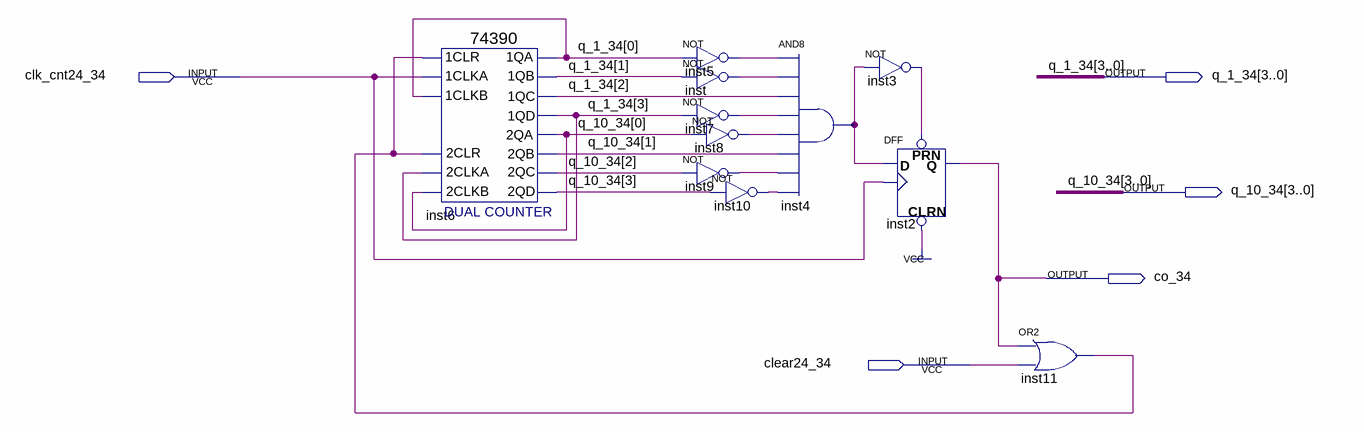
[diagram p0: schematic sheet]
// Quartus schematic cnt24_34.bdf as structural Verilog: 11 symbols, 5 pins
module cnt24_34 (
  input  clk_cnt24_34,
  input  clear24_34,
  output [3:0] q_1_34,
  output [3:0] q_10_34,
  output co_34
);

  wire inst3_out, inst4_out, inst5_out, inst7_out, inst8_out, inst9_out, inst10_out, inst11_out, inst_out;

  \74390  inst6 (
    .\2CLKA (q_1_34[3]), .\2CLR (inst11_out), .\2CLKB (q_10_34[0]), .\1CLR (inst11_out),
    .\1CLKA (clk_cnt24_34), .\1CLKB (q_1_34[0]), .\1QA (q_1_34[0]), .\1QB (q_1_34[1]), .\1QC (q_1_34[2]),
    .\1QD (q_1_34[3]), .\2QA (q_10_34[0]), .\2QB (q_10_34[1]), .\2QC (q_10_34[2]), .\2QD (q_10_34[3]));
  not inst5 (inst5_out, q_1_34[0]);
  not inst (inst_out, q_1_34[1]);
  not inst7 (inst7_out, q_1_34[3]);
  not inst8 (inst8_out, q_10_34[0]);
  not inst9 (inst9_out, q_10_34[2]);
  not inst10 (inst10_out, q_10_34[3]);
  and inst4 (inst4_out, inst5_out, inst_out, q_1_34[2], inst7_out, inst8_out, q_10_34[1], inst9_out, inst10_out);
  not inst3 (inst3_out, inst4_out);
  DFF inst2 (.CLRN(1'b1), .CLK(clk_cnt24_34), .D(inst4_out), .PRN(inst3_out), .Q(co_34));
  or inst11 (inst11_out, co_34, clear24_34);
endmodule
